# EasyEDA schematic schematic.easyeda.json
TITLE: MicroEnv Sensor; REV: 2.0; Date: 2026-01-02; Sheet: 1/1; Drawn By: Joshua M. Boniface; Company: Boniface Labs
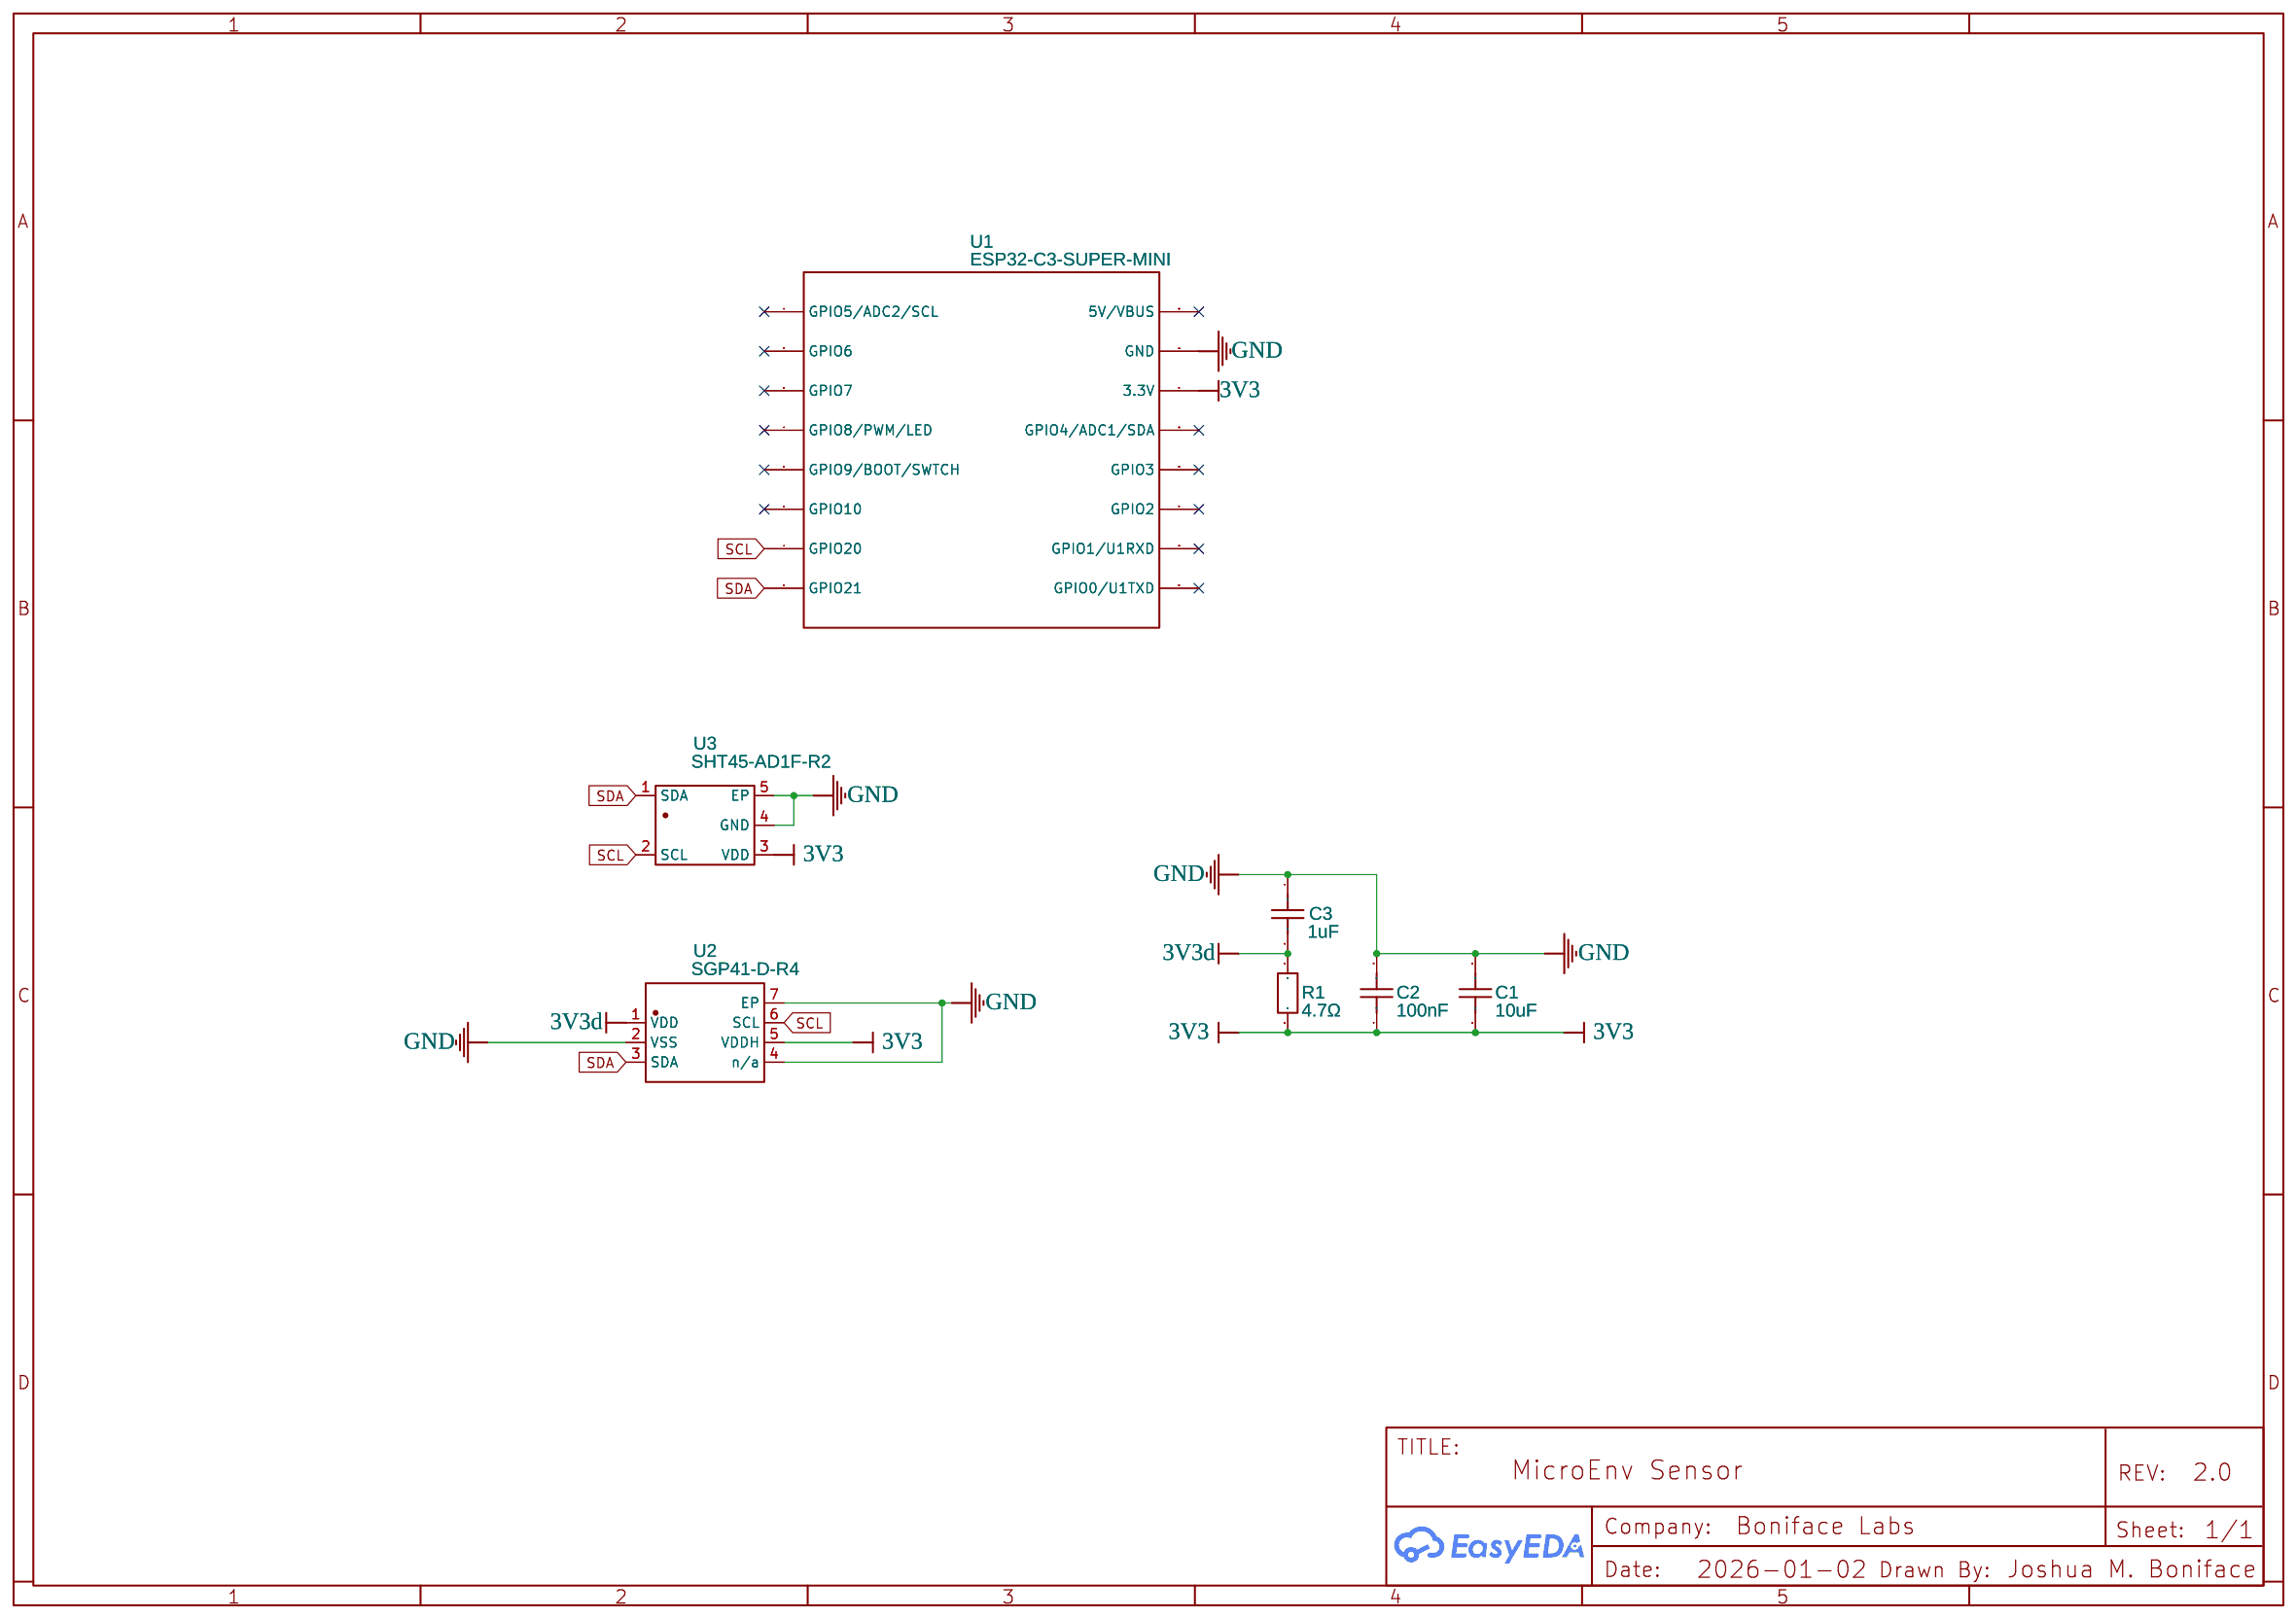
[diagram p0: schematic sheet]

## Parts
C1  10uF  [C0805]
C2  100nF  [C0805]
C3  1uF  [C0805]
R1  4.7Ω  [R1206]
U1  ESP32-C3-SUPER-MINI  [ESP32-C3-SUPER-MINI]
U2  SGP41-D-R4  [DFN-6_L2.4-W2.4-P0.80-TL-EP]
U3  SHT45-AD1F-R2  [DFN-4_L1.5-W1.5-P0.8-TL-EP]

## Library data of the parts
C1 = C2012JB1C106K125AB: Contributor: lcsc; Supplier: LCSC; Supplier Part: C3905660; Manufacturer: TDK; JLCPCB Part Class: Extended Part
C2 = C2012JB2A104K125AA: Contributor: lcsc; Supplier: LCSC; Supplier Part: C3875091; Manufacturer: TDK; JLCPCB Part Class: Extended Part
C3 = C2012X5R1E105K085AC: Contributor: lcsc; Supplier: LCSC; Supplier Part: C3905748; Manufacturer: TDK; JLCPCB Part Class: Extended Part
R1 = CRGP1206F4K7: Supplier: LCSC; Supplier Part: C2074453; Manufacturer: TE Connectivity(泰科电子); JLCPCB Part Class: Extended Part; Contributor: lcsc
U1 = ESP32-C3-SUPER-MINI: Manufacturer: Maker go; link: https://www.tindie.com/products/adz1122/esp32-c3-development-board-esp32-supermini/; Contributor: 122043975
U2 = SGP41-D-R4: Contributor: lcsc; Supplier: LCSC; Supplier Part: C3659325; Manufacturer: Sensirion(瑞士盛思锐); JLCPCB Part Class: Extended Part
U3 = SHT45-AD1F-R2: Supplier: LCSC; Supplier Part: C5360602; Manufacturer: Sensirion(瑞士盛思锐); JLCPCB Part Class: Extended Part; Contributor: lcsc

## Nets
3V3: C1.1 C2.1 R1.2 U1.14(3.3V) U2.5(VDDH) U3.3(VDD)
3V3d: C3.2 R1.1 U2.1(VDD)
GND: C1.2 C2.2 C3.1 U1.15(GND) U2.2(VSS) U2.4(n/a) U2.7(EP) U3.4(GND) U3.5(EP)
SCL: U1.7(GPIO20) U2.6(SCL) U3.2(SCL)
SDA: U1.8(GPIO21) U2.3(SDA) U3.1(SDA)

Not connected (* = marked no-connect by the designer): U1 1(GPIO5/ADC2/SCL)* 2(GPIO6)* 3(GPIO7)* 4(GPIO8/PWM/LED)* 5(GPIO9/BOOT/SWTCH)* 6(GPIO10)* 9(GPIO0/U1TXD)* 10(GPIO1/U1RXD)* 11(GPIO2)* 12(GPIO3)* 13(GPIO4/ADC1/SDA)* 16(5V/VBUS)*
